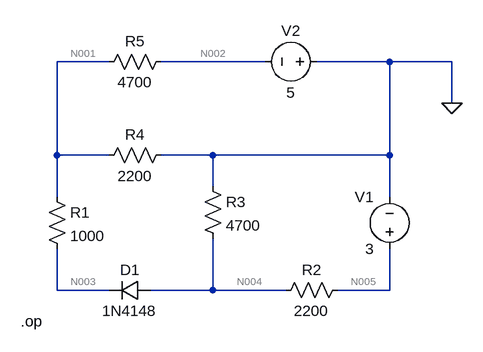
[diagram p0: schematic Figure46.asc]
Figure46.asc, the LTspice schematic file:
Version 4.1
SHEET 1 880 680
WIRE 32 -16 -48 -16
WIRE 272 -16 112 -16
WIRE 464 -16 352 -16
WIRE 560 -16 464 -16
WIRE 560 48 560 -16
WIRE -48 128 -48 -16
WIRE 32 128 -48 128
WIRE 192 128 112 128
WIRE 464 128 464 -16
WIRE 464 128 192 128
WIRE 192 176 192 128
WIRE -48 192 -48 128
WIRE 464 192 464 128
WIRE -48 336 -48 272
WIRE 32 336 -48 336
WIRE 192 336 192 256
WIRE 192 336 96 336
WIRE 304 336 192 336
WIRE 464 336 464 272
WIRE 464 336 384 336
FLAG 560 48 0
SYMBOL res -64 176 R0
SYMATTR InstName R1
SYMATTR Value 1000
SYMBOL res 400 320 R90
WINDOW 0 0 56 VBottom 2
WINDOW 3 32 56 VTop 2
SYMATTR InstName R2
SYMATTR Value 2200
SYMBOL voltage 464 288 R180
WINDOW 0 24 96 Left 2
WINDOW 3 24 16 Left 2
WINDOW 123 0 0 Left 0
WINDOW 39 0 0 Left 0
SYMATTR InstName V1
SYMATTR Value 3
SYMBOL res 176 160 R0
SYMATTR InstName R3
SYMATTR Value 4700
SYMBOL res 128 112 R90
WINDOW 0 0 56 VBottom 2
WINDOW 3 32 56 VTop 2
SYMATTR InstName R4
SYMATTR Value 2200
SYMBOL res 128 -32 R90
WINDOW 0 0 56 VBottom 2
WINDOW 3 32 56 VTop 2
SYMATTR InstName R5
SYMATTR Value 4700
SYMBOL voltage 368 -16 R90
WINDOW 0 -32 56 VBottom 2
WINDOW 3 32 56 VTop 2
WINDOW 123 0 0 Left 0
WINDOW 39 0 0 Left 0
SYMATTR InstName V2
SYMATTR Value 5
SYMBOL diode 96 320 R90
WINDOW 0 0 32 VBottom 2
WINDOW 3 32 32 VTop 2
SYMATTR InstName D1
SYMATTR Value 1N4148
TEXT -104 384 Left 2 !.op

The netlist it stands for:
* Figure46.asc
R1 N001 N003 1000
R2 N005 N004 2200
V1 N005 0 3
R3 0 N004 4700
R4 0 N001 2200
R5 N002 N001 4700
V2 0 N002 5
D1 N004 N003 1N4148
.model D D
.lib standard.dio
.op
.backanno
.end

* Results of the author's LTspice run, read from the files saved beside the schematic
* Operating Point:
*   V(n001) = -445.1 mV
*   V(n002) = -5 V
*   V(n003) = 321.8 mV
*   V(n004) = 894.3 mV
*   V(n005) = 3 V
*   I(D1) = 766.8 µA
*   I(R1) = -766.8 µA
*   I(R2) = 957.1 µA
*   I(R3) = -190.3 µA
*   I(R4) = 202.3 µA
*   I(R5) = -969.1 µA
*   I(V1) = -957.1 µA
*   I(V2) = -969.1 µA